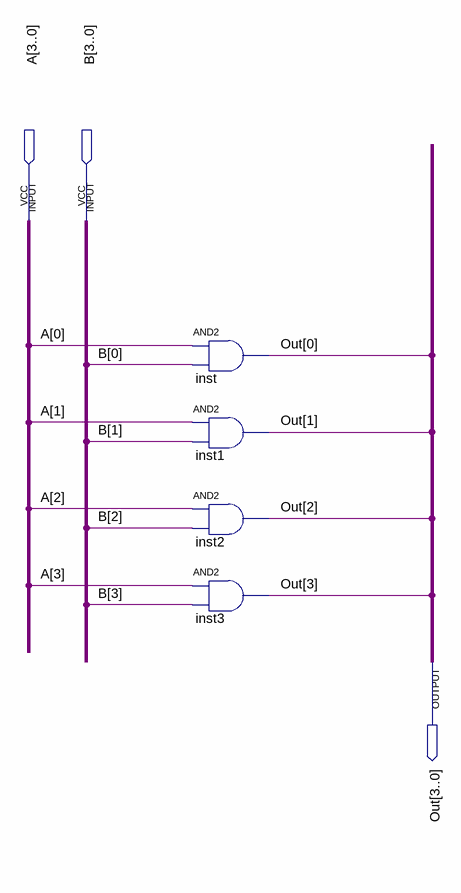
[diagram p0: schematic sheet]
// Quartus schematic And_completo.bdf as structural Verilog: 4 symbols, 3 pins
module And_completo (
  input  [3:0] A,
  input  [3:0] B,
  output [3:0] Out
);

  and inst (Out[0], A[0], B[0]);
  and inst1 (Out[1], A[1], B[1]);
  and inst2 (Out[2], A[2], B[2]);
  and inst3 (Out[3], A[3], B[3]);
endmodule
